# Altium schematic sheet MCU.SchDoc
size A; SheetNumber: 2
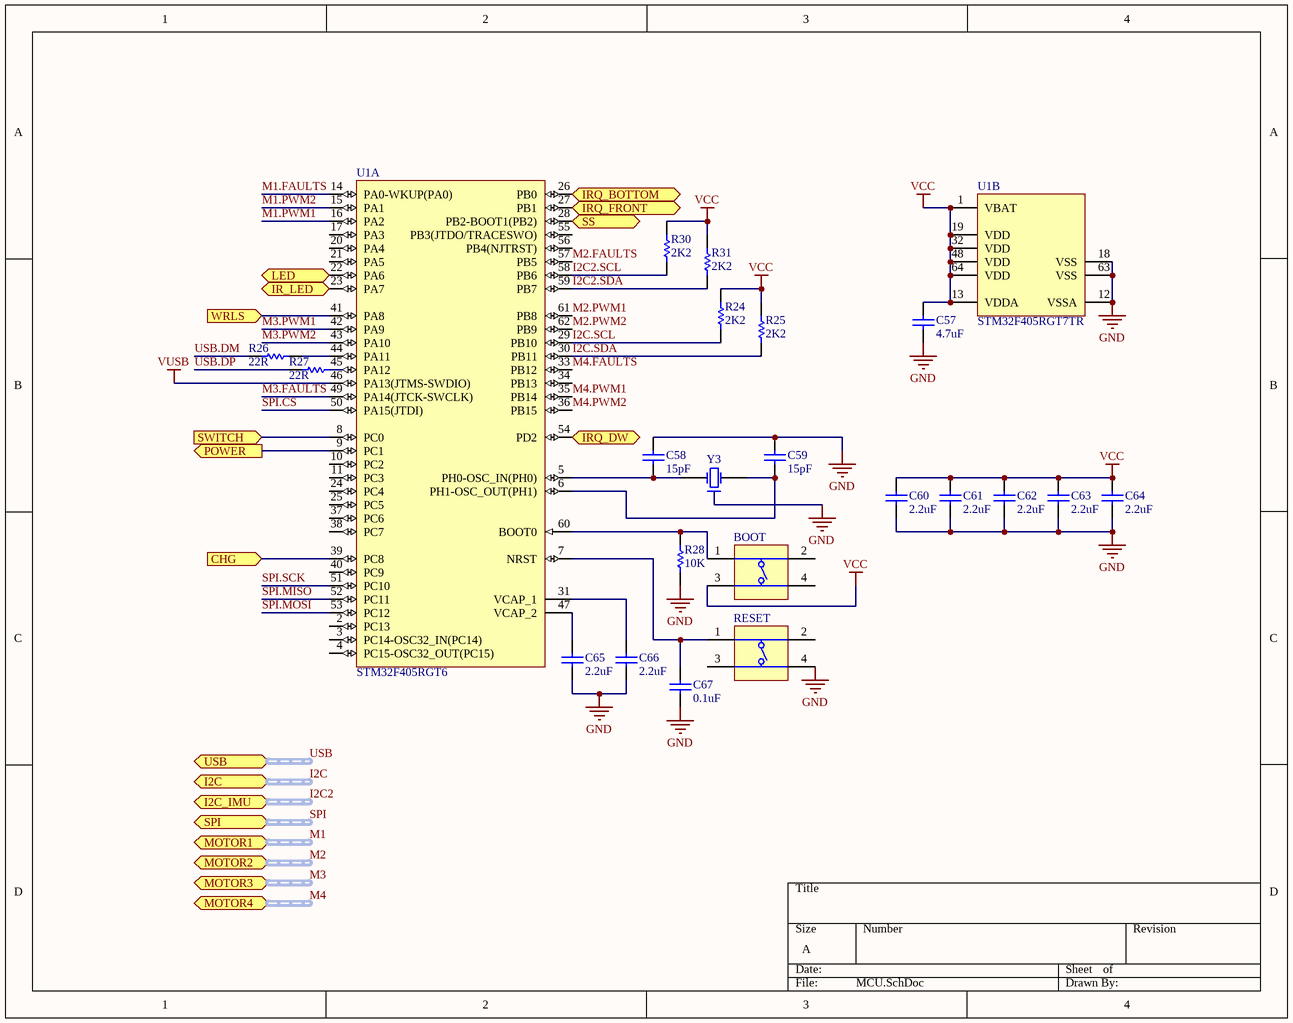
[diagram p0: MCU.SchDoc]

## Parts
BOOT  (no value)  [SWITCH]
C57  value 4.7uF  [C0402[1005X55]]  (hidden comment: 4.7uF 6.3V 0402)
C58  value 15pF  [C0402[1005X55]]  (hidden comment: 15pF 50V 0402)
C59  value 15pF  [C0402[1005X55]]  (hidden comment: 15pF 50V 0402)
C60  value 2.2uF  [C0402[1005X55]]  (hidden comment: 2.2uF 6.3V 0402)
C61  value 2.2uF  [C0402[1005X55]]  (hidden comment: 2.2uF 6.3V 0402)
C62  value 2.2uF  [C0402[1005X55]]  (hidden comment: 2.2uF 6.3V 0402)
C63  value 2.2uF  [C0402[1005X55]]  (hidden comment: 2.2uF 6.3V 0402)
C64  value 2.2uF  [C0402[1005X55]]  (hidden comment: 2.2uF 6.3V 0402)
C65  value 2.2uF  [C0402[1005X55]]  (hidden comment: 2.2uF 6.3V 0402)
C66  value 2.2uF  [C0402[1005X55]]  (hidden comment: 2.2uF 6.3V 0402)
C67  value 0.1uF  [C0402[1005X55]]  (hidden comment: 0.1uF 6.3V 0402)
R24  value 2K2  [R0402[1005]]  (hidden comment: 2K2 1% 0402)
R25  value 2K2  [R0402[1005]]  (hidden comment: 2K2 1% 0402)
R26  value 22R  [R0402[1005]]  (hidden comment: 22R 1% 0402)
R27  value 22R  [R0402[1005]]  (hidden comment: 22R 1% 0402)
R28  value 10K  [R0402[1005]]  (hidden comment: 10K 1% 0402)
R30  value 2K2  [R0402[1005]]  (hidden comment: 2K2 1% 0402)
R31  value 2K2  [R0402[1005]]  (hidden comment: 2K2 1% 0402)
RESET  (no value)  [SWITCH]
U1  STM32F405RGT6  [STM-LQFP64_L]  (parts A,B of 2)
Y3  (no value)  [ABRA-ABM3B-4_V]

## Ports
CHG (in), I2C (harness I2C), I2C_IMU (harness I2C), IR_LED (out), IRQ_BOTTOM (in), IRQ_DW (in), IRQ_FRONT (in), LED (out), MOTOR1 (harness Motor), MOTOR2 (harness Motor), MOTOR3 (harness Motor), MOTOR4 (harness Motor), POWER (out), SPI (harness SPI), SS (out), SWITCH (in), USB (harness USB), WRLS (in)

## Nets
GND: C57.1 C58.2 C59.2 C60.1 C61.1 C62.1 C63.1 C64.1 C65.1 C66.1 C67.1 R28.1 RESET.4(T3) U1.12(VSSA) U1.18(VSS) U1.63(VSS) Y3.2
VCC: BOOT.3(T3) C57.2 C60.2 C61.2 C62.2 C63.2 C64.2 R24.2 R25.2 R30.2 R31.2 U1.1(VBAT) U1.13(VDDA) U1.19(VDD) U1.32(VDD) U1.48(VDD) U1.64(VDD)
VUSB: U1.46(PA13(JTMS-SWDIO))
CHG: U1.39(PC8) ; port CHG
I2C2.SCL: R30.1 U1.58(PB6)
I2C2.SDA: R31.1 U1.59(PB7)
I2C.SCL: R24.1 U1.29(PB10)
I2C.SDA: R25.1 U1.30(PB11)
IR_LED: U1.23(PA7) ; port IR_LED
IRQ_BOTTOM: U1.26(PB0) ; port IRQ_BOTTOM
IRQ_DW: U1.54(PD2) ; port IRQ_DW
IRQ_FRONT: U1.27(PB1) ; port IRQ_FRONT
LED: U1.22(PA6) ; port LED
M1.FAULTS: U1.14(PA0-WKUP(PA0))
M1.PWM1: U1.16(PA2)
M1.PWM2: U1.15(PA1)
M2.FAULTS: U1.57(PB5)
M2.PWM1: U1.61(PB8)
M2.PWM2: U1.62(PB9)
M3.FAULTS: U1.49(PA14(JTCK-SWCLK))
M3.PWM1: U1.42(PA9)
M3.PWM2: U1.43(PA10)
M4.FAULTS: U1.33(PB12)
M4.PWM1: U1.35(PB14)
M4.PWM2: U1.36(PB15)
POWER: U1.9(PC1) ; port POWER
SPI.CS: U1.50(PA15(JTDI))
SPI.MISO: U1.52(PC11)
SPI.MOSI: U1.53(PC12)
SPI.SCK: U1.51(PC10)
SS: U1.28(PB2-BOOT1(PB2)) ; port SS
SWITCH: U1.8(PC0) ; port SWITCH
USB.DM: R26.1
USB.DP: R27.1
WRLS: U1.41(PA8) ; port WRLS
NetBOOT_1: BOOT.1(T1) R28.2 U1.60(BOOT0)
NetC58_1: C58.1 U1.5(PH0-OSC_IN(PH0)) Y3.3(X2)
NetC59_1: C59.1 U1.6(PH1-OSC_OUT(PH1)) Y3.1(X1)
NetC65_2: C65.2 U1.47(VCAP_2)
NetC66_2: C66.2 U1.31(VCAP_1)
NetC67_2: C67.2 RESET.1(T1) U1.7(NRST)
NetR26_2: R26.2 U1.44(PA11)
NetR27_2: R27.2 U1.45(PA12)

Not connected (* = marked no-connect by the designer): BOOT 2(T2) 4(T3); RESET 2(T2) 3(T3); U1 2(PC13) 3(PC14-OSC32_IN(PC14)) 4(PC15-OSC32_OUT(PC15)) 10(PC2) 11(PC3) 17(PA3) 20(PA4) 21(PA5) 24(PC4) 25(PC5) 34(PB13) 37(PC6) 38(PC7) 40(PC9) 55(PB3(JTDO/TRACESWO)) 56(PB4(NJTRST))

## Buses and harness runs
harness I2C2 = port I2C_IMU
harness I2C = port I2C
harness M1 = port MOTOR1
harness M2 = port MOTOR2
harness M3 = port MOTOR3
harness M4 = port MOTOR4
harness SPI = port SPI
harness USB = port USB

## Library data of the parts
BOOT RESET = DIPT-DTSM-6: Switch, SPNO Push Button SMD; Manufacturer: C&K Components; PartNumber: PTS810 SJM 250 SMTR LFS; Packing Type: Tape&Reel; Mechanical Life: 200,000 cycles; ComponentLink2URL: http://www.dip.com.tw/Products_tact.htm; ComponentLink1URL: http://www.dip.com.tw/; ComponentLink3URL: http://www.dip.com.tw/PDF/pro_tact/DTSM_G_-6_2_-V.pdf; PackageDescription: Switch, Surface Mount, 4 Leads, Body 4.6x2.8mm, Height 1.9mm; ComponentLink2Description: Datasheet; ComponentLink3Description: Package Specification; ComponentLink1Description: Manufacturer URL; PackageReference: PTS810; Mounting Technology: Surface Mount
C57 = CAP_4.7uF_6.3V_0402_20%: 4.7uF 6.3V 20% 0402 (1005 Metric); PartNumber: GRM155R60J475ME47D; Manufacturer: Murata; Tolerance: 20%; Mounting Technology: Surface Mount; PackageReference: 0402; PackageDescription: 0402 (1005 Metric); Voltage: 6.3V
C58 C59 = CAP_15pF_50V_0402_5%: 15pF 50V 5% 0402 (1005 Metric); PartNumber: GRM1555C1H150JA01D; Manufacturer: Murata; Tolerance: 5%; Mounting Technology: Surface Mount; PackageReference: 0402; PackageDescription: 0402 (1005 Metric); Voltage: 50V
C60-C66 = CAP_2.2uF_6.3V_0402_20%: 2.2uF 6.3V 20% 0402 (1005 Metric); PartNumber: GRM155R60J225ME15D; Manufacturer: Murata; Tolerance: 20%; Mounting Technology: Surface Mount; PackageReference: 0402; PackageDescription: 0402 (1005 Metric); Voltage: 6.3V
C67 = CAP_0.1uF_6.3V_0402_10%: 0.1uF 6.3V 10% 0402 (1005 Metric); PartNumber: GRM155R70J104KA01D; Manufacturer: Murata; Tolerance: 10%; Mounting Technology: Surface Mount; PackageReference: 0402; PackageDescription: 0402 (1005 Metric); Voltage: 6.3V
R24 R25 R30 R31 = RES_2K2_0402_1%: 2K2 0.063W 1% 0402 (1005 Metric); Manufacturer: KOA Speer; PartNumber: RK73H1ETTP2201F; Tolerance: 1%; Power: 0.063W; Mounting Technology: Surface Mount; PackageReference: 0402; PackageDescription: 0402 (1005 Metric); ComponentLink1Description: Datasheet; ComponentLink1URL: http://www.koaspeer.com/catimages/Products/RK73H/RK73H.pdf
R26 R27 = RES_22R_0402_1%: 22R 0.063W 1% 0402 (1005 Metric); Manufacturer: KOA Speer; PartNumber: RK73H1ETTP22R0F; Power: 0.063W; Tolerance: 1%; Mounting Technology: Surface Mount; PackageReference: 0402; PackageDescription: 0402 (1005 Metric); ComponentLink1Description: Datasheet; ComponentLink1URL: http://www.koaspeer.com/catimages/Products/RK73H/RK73H.pdf
R28 = RES_10K_0402_1%: 10K 0.063W 1% 0402 (1005 Metric); Manufacturer: KOA Speer; PartNumber: RK73H1ETTP1002F; Tolerance: 1%; Power: 0.063W; Mounting Technology: Surface Mount; PackageReference: 0402; PackageDescription: 0402 (1005 Metric); ComponentLink1Description: Datasheet; ComponentLink1URL: http://www.koaspeer.com/catimages/Products/RK73H/RK73H.pdf
U1 = CMP-0243-00089-2: ARM Cortex-M4 32-bit MCU+FPU, 210 DMIPS, 1024 kB Flash, 192 kB Internal RAM, 51 I/Os, 64-pin LQFP, -40 to 105 degC, Tape and Reel; Manufacturer: STMicroelectronics; FLASH Size (Prog) (kB): 1024; Supply Voltage(Vcc) max (V): 3.6; Internal RAM Size (kB): 192; Supply Voltage(Vcc) min (V): 1.8; Operating Frequency(F) (Processor speed) (MHz): 168; D/A Converter: 2x12-bit; I/Os (High Current): 51; ComponentLink2Description: Datasheet; Core: ARM Cortex-M4; PackageVersion: Rev. 4, 06/2013; ComponentLink1URL: http://www.st.com/web/en/home.html; PackageReference: LQFP64; Mounting Technology: Surface Mount; ComponentLink1Description: Manufacturer URL; PackageDescription: 64-Pin Low Profile Quad Flat Package, 10 x 10 mm Body, 0.5 mm Pitch; ComponentLink3Description: Package Specification; ComponentLink2URL: http://www.st.com/st-web-ui/static/active/en/resource/technical/document/datasheet/DM00037051.pdf; PartNumber: STM32F405RGT6; ComponentLink3URL: http://www.st.com/st-web-ui/static/active/en/resource/technical/document/datasheet/DM00037051.pdf; Packing: Tape and Reel; DatasheetVersion: Rev. 4; PartId: 1
Y3 = ABRA-ABM3B-4: PartNumber: ABM3B-8.000MHZ-10-1UT; Manufacturer: ABRACON; Mounting Technology: Surface Mount; PackageReference: 2012; PackageDescription: 2012 (5032 metric)